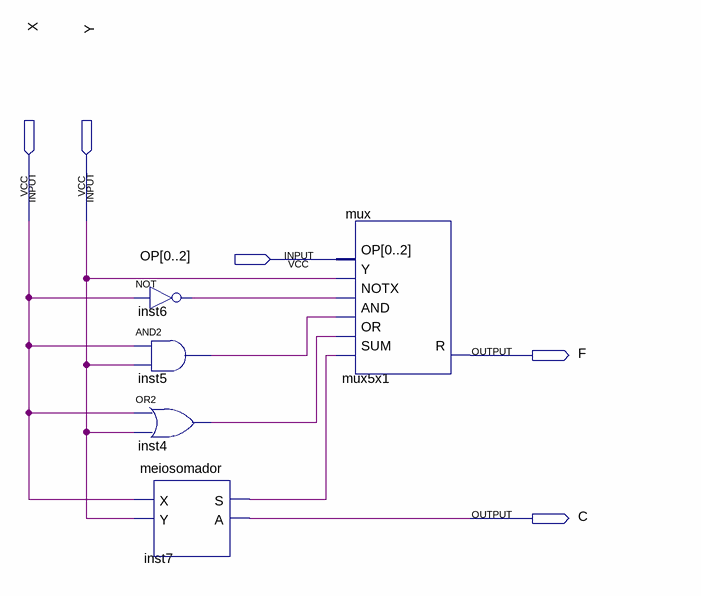
[diagram p0: schematic sheet]
// Quartus schematic ulaneander1bit.bdf as structural Verilog: 5 symbols, 5 pins
module ulaneander1bit (
  input  X,
  input  Y,
  input  [0:2] OP,
  output F,
  output C
);

  wire inst4_out, inst5_out, inst6_out, inst7_s;

  not inst6 (inst6_out, X);
  and inst5 (inst5_out, X, Y);
  or inst4 (inst4_out, X, Y);
  meiosomador inst7 (.X(X), .Y(Y), .S(inst7_s), .A(C));
  mux5x1 mux (.SUM(inst7_s), .OR(inst4_out), .AND(inst5_out), .NOTX(inst6_out), .Y(Y), .OP(OP), .R(F));
endmodule
